# EAGLE design audio (EAGLE 7.7.0)
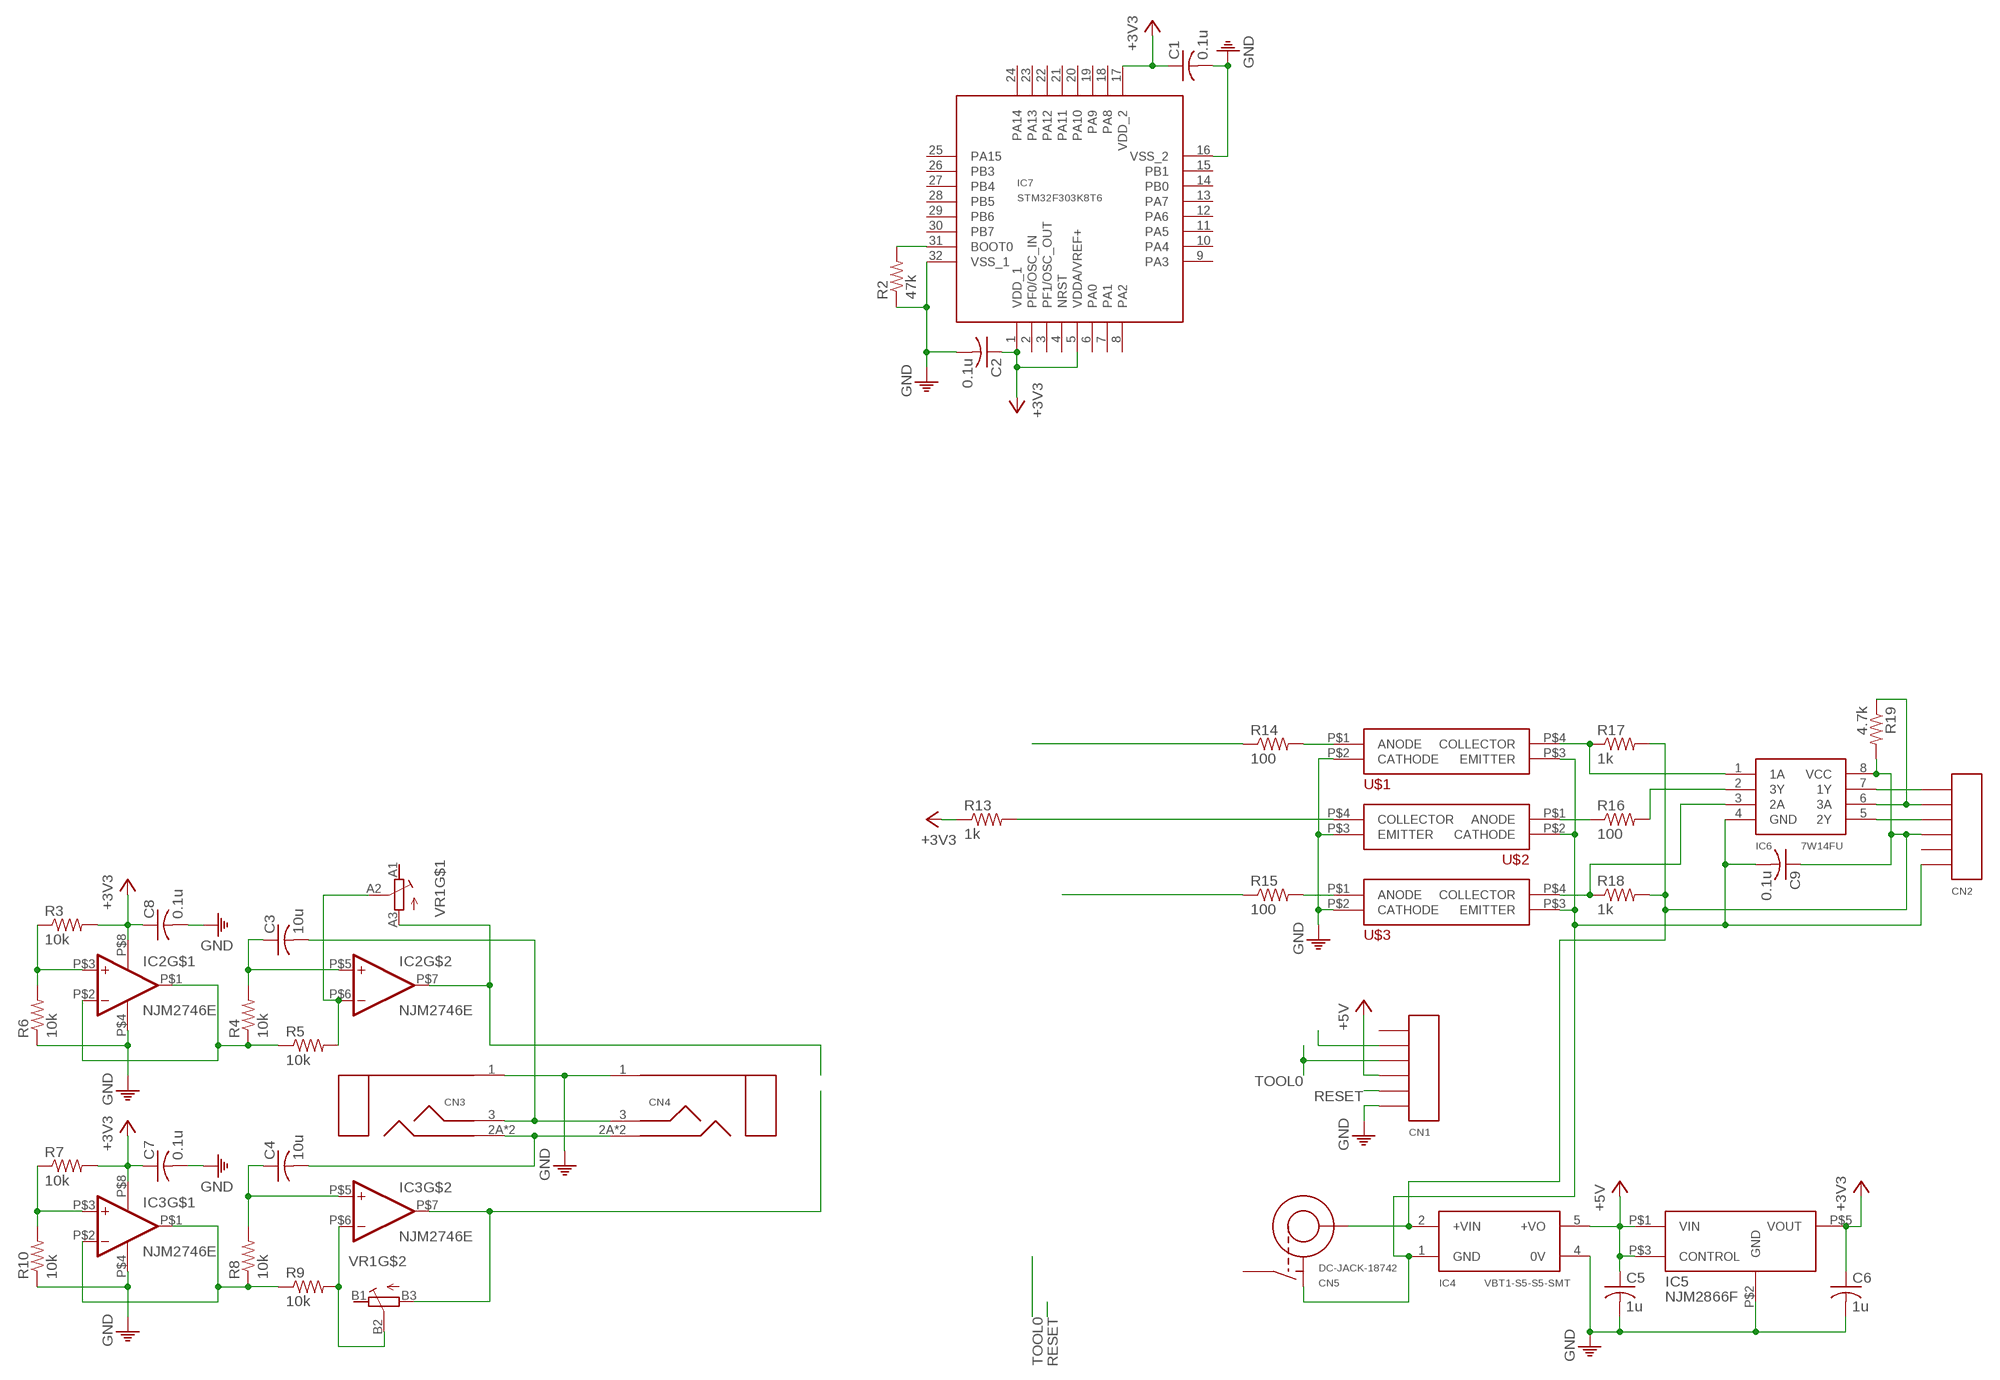
[diagram p0: schematic, sheet 1]

## Parts
C1  0.1u  C2012  [C2012]
C2  0.1u  C2012  [C2012]
C3  10u  C2012  [C2012]
C4  10u  C2012  [C2012]
C5  1u  C2012  [C2012]
C6  1u  C2012  [C2012]
C7  0.1u  C2012  [C2012]
C8  0.1u  C2012  [C2012]
C9  0.1u  C2012  [C2012]
CN1  PH-1X06SG  [PH-1X06SG]
CN2  PH-1X06RG  [PH-1X06RG]
CN3  STEREO-3.5-MJ8435  [MJ8435]
CN4  STEREO-3.5-MJ8435  [MJ8435]
CN5  DC-JACK-18742  [18742]
IC2  NJM2746E  [EMP8]
IC3  NJM2746E  [EMP8]
IC4  VBT1-S5-S5-SMT  [VBT1-S5-S5-SMT]
IC5  NJM2866F  [SOT-23-5]
IC6  7W14FU  [SSOP8-P-0.65]
IC7  STM32F303K8T6  [P-LQFP32-7X7-0.80]
R2  47k  R2012  [R2012]
R3  10k  R2012  [R2012]
R4  10k  R2012  [R2012]
R5  10k  R2012  [R2012]
R6  10k  R2012  [R2012]
R7  10k  R2012  [R2012]
R8  10k  R2012  [R2012]
R9  10k  R2012  [R2012]
R10  10k  R2012  [R2012]
R13  1k  R2012  [R2012]
R14  100  R2012  [R2012]
R15  100  R2012  [R2012]
R16  100  R2012  [R2012]
R17  1k  R2012  [R2012]
R18  1k  R2012  [R2012]
R19  4.7k  R2012  [R2012]
U$1  TLP291  [11-3C1]
U$2  TLP291  [11-3C1]
U$3  TLP291  [11-3C1]
VR1  R-TRIM-RK0971220  [RK0971220-F15-C0-A104]

## Nets
+3V3: C1.1 C2.1 C6.1 C7.1 C8.1 IC2.P$8(V+) IC3.P$8(V+) IC5.P$5(VOUT) IC7.1(VDD_1) IC7.5(VDDA/VREF+) IC7.17(VDD_2) R3.2 R7.2 R13.1
+5V: C5.1 CN1.P$4 IC4.5(+VO) IC5.P$1(VIN) IC5.P$3(CONTROL)
GND: C1.2 C2.2 C5.2 C6.2 C7.2 C8.2 CN1.P$6 CN3.1(SLEEVE) CN4.1(SLEEVE) IC2.P$4(V-) IC3.P$4(V-) IC4.4(0V) IC5.P$2(GND) IC7.16(VSS_2) IC7.32(VSS_1) R2.1 R6.1 R10.1 U$1.P$2(CATHODE) U$2.P$3(EMITTER) U$3.P$2(CATHODE)
N$1: IC2.P$1(OUT) IC2.P$2(-IN) R4.1 R5.1
N$2: IC7.31(BOOT0) R2.2
N$3: C3.2 CN3.3(RING) CN4.3(RING)
N$4: CN1.P$2
N$5: C3.1 IC2.P$5(+IN) R4.2
N$6: IC2.P$3(+IN) R3.1 R6.2
N$7: C9.2 CN2.P$6 CN5.P$2(TIP) IC4.1(GND) IC6.4(GND) U$1.P$3(EMITTER) U$2.P$2(CATHODE) U$3.P$3(EMITTER)
N$8: C9.1 CN2.P$4 CN5.P$1(CENTER) IC4.2(+VIN) IC6.8(VCC) R17.2 R18.2 R19.2
N$9: IC2.P$6(-IN) R5.2 VR1.A2(S)
N$10: IC2.P$7(OUT) VR1.A3(E)
N$11: IC3.P$1(OUT) IC3.P$2(-IN) R8.1 R9.1
N$12: IC3.P$3(+IN) R7.1 R10.2
N$13: C4.1 IC3.P$5(+IN) R8.2
N$14: IC3.P$6(-IN) R9.2 VR1.B2(S)
N$15: C4.2 CN3.2A(TIP) CN3.2B(TIP) CN4.2A(TIP) CN4.2B(TIP)
N$16: IC3.P$7(OUT) VR1.B3(E)
N$17: R14.1
N$18: R13.2 U$2.P$4(COLLECTOR)
N$19: R15.1
N$20: R14.2 U$1.P$1(ANODE)
N$21: IC6.3(2A) R18.1 U$3.P$4(COLLECTOR)
N$22: R15.2 U$3.P$1(ANODE)
N$23: R16.1 U$2.P$1(ANODE)
N$24: CN2.P$1 IC6.7(1Y)
N$25: IC6.1(1A) R17.1 U$1.P$4(COLLECTOR)
N$26: CN2.P$2 IC6.6(3A) R19.1
N$27: CN2.P$3 IC6.5(2Y)
N$28: IC6.2(3Y) R16.2
RESET: CN1.P$5
TOOL0: CN1.P$3
Unconnected: CN1.P$1 CN2.P$5 CN5.P$3(SHUNT) IC7.2(PF0/OSC_IN) IC7.3(PF1/OSC_OUT) IC7.4(NRST) IC7.6(PA0) IC7.7(PA1) IC7.8(PA2) IC7.9(PA3) IC7.10(PA4) IC7.11(PA5) IC7.12(PA6) IC7.13(PA7) IC7.14(PB0) IC7.15(PB1) IC7.18(PA8) IC7.19(PA9) IC7.20(PA10) IC7.21(PA11) IC7.22(PA12) IC7.23(PA13) IC7.24(PA14) IC7.25(PA15) IC7.26(PB3) IC7.27(PB4) IC7.28(PB5) IC7.29(PB6) IC7.30(PB7) VR1.A1(A) VR1.B1(A)

## Library data of the parts
C1-C9 = MyLib:C: CAPACITOR, American symbol
CN1 CN2 = MyLib:PH-1X06
CN3 CN4 = MyLib:STEREO
CN5 = MyLib:DC-JACK
IC2 IC3 = MyLib:NJM2746
IC4 = MyLib:VBT1-S5-S5-SMT
IC5 = MyLib:NJM2866F
IC6 = MyLib:7*14
IC7 = MyLib:STM32F303K8T6
R2-R10 R13-R19 = MyLib:R: RESISTOR, American symbol
U$1-U$3 = MyLib:TLP291
VR1 = MyLib:R-TRIM

## Board
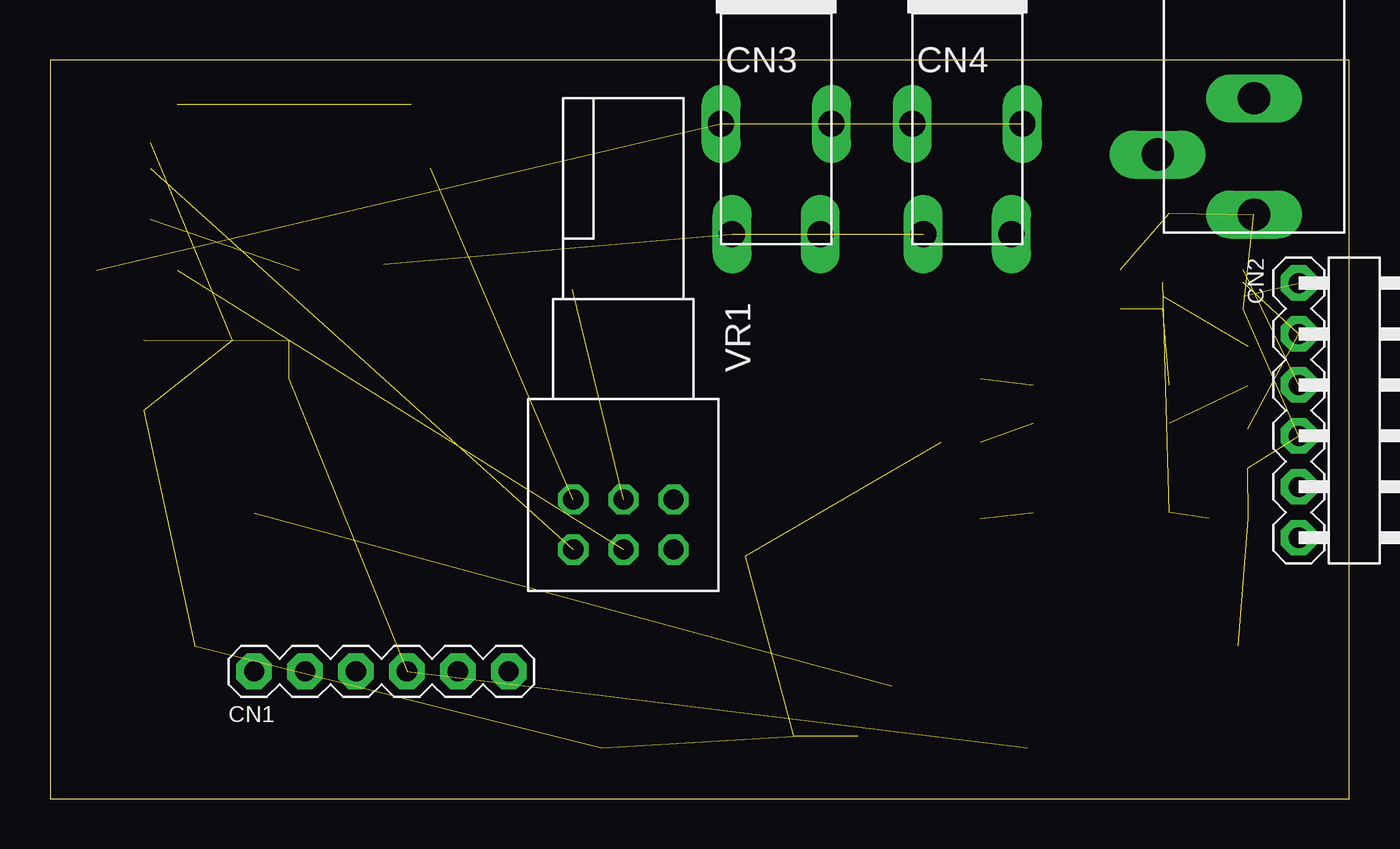
[diagram p1: board, top side]
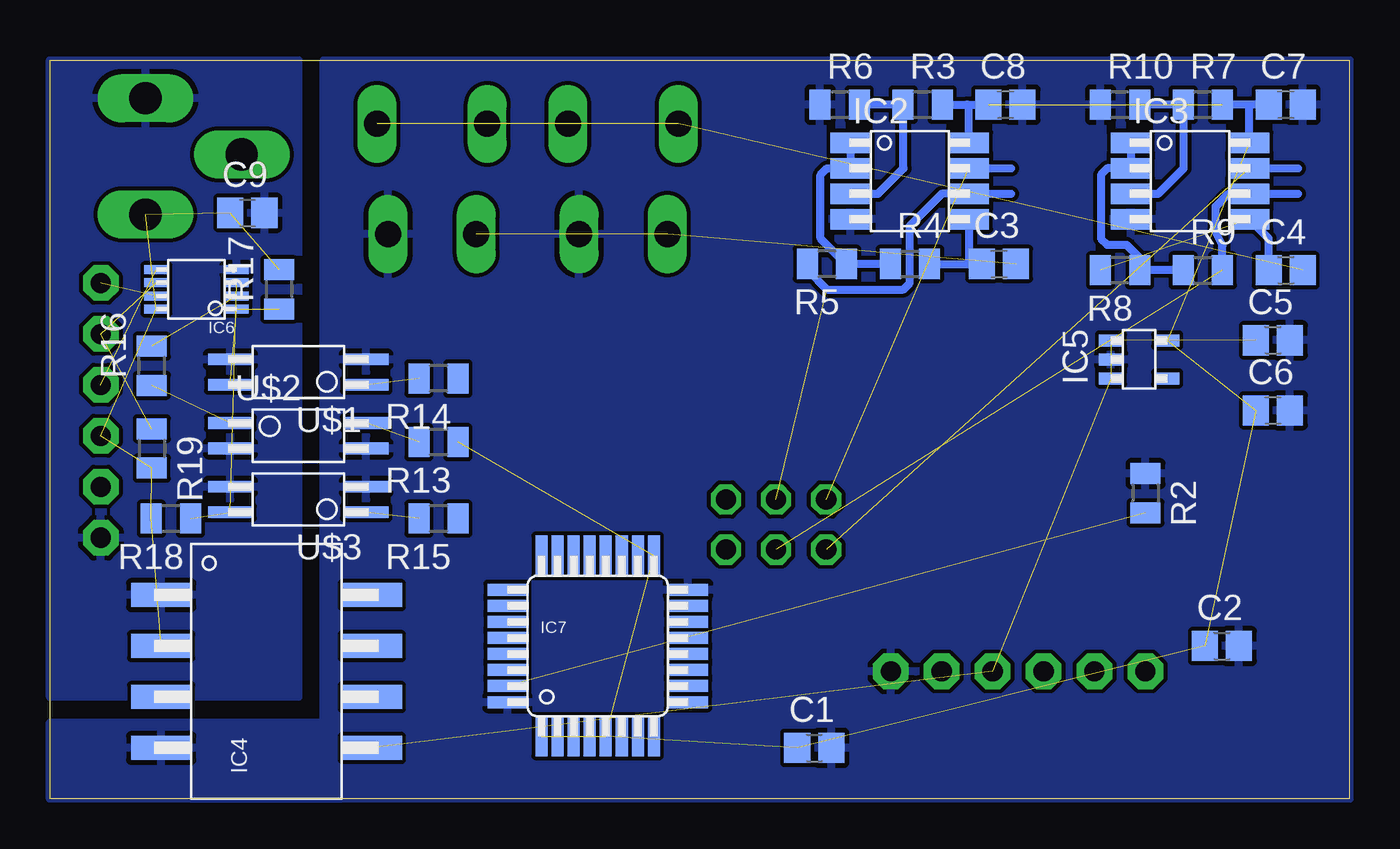
[diagram p2: board, bottom side, seen from below]

Size 64.76 x 36.82 mm. Coordinates in mm from the lower left corner, seen from the top.
Outline: 0,0 64.76,0 64.76,36.82 0,36.82 0,0
Copper layers (1*16): Top 0.0356mm / dielectric 1.5011mm / Bottom 0.0356mm
Design rules "formitaminimum": minimum track width 5mil, minimum drill 0.5994mm, track to track 0.2007mm, track to pad 0.2007mm, pad to pad 0.2007mm, via to via 0.2007mm, smd to smd 0mil, copper to edge 0mil, drill to drill 1mil, minimum pad ring 10mil, minimum via ring 8mil, stop-mask expansion 4mil, vias tented up to drill 0mil, thermal gap 10mil

### Footprints (pad centres in the part's own frame; a part is rotated, then mirrored left to right if it is on the bottom)
C2012 = smd 1.3 x 1.5: 1 -0.85,0; 2 0.85,0
PH-1X06SG = drill 1 pad 1.778 octagon: P$1 -6.35,0; P$2 -3.81,0; P$3 -1.27,0; P$4 1.27,0; P$5 3.81,0; P$6 6.35,0
PH-1X06RG = drill 1 pad 1.778 octagon: P$1 -6.35,0; P$2 -3.81,0; P$3 -1.27,0; P$4 1.27,0; P$5 3.81,0; P$6 6.35,0
MJ8435 = drill 1.3 long: 1 2.2,-5.5; 2A -2.75,0; 2B 2.75,0; 3 -2.2,-5.5
18742 = drill 1.6 long: P$1 5.8,0; P$2 0,0; P$3 2.8,-4.8
EMP8 = smd 2 x 1.016: P$1 -2.95,1.905; P$2 -2.95,0.635; P$3 -2.95,-0.635; P$4 -2.95,-1.905; P$5 2.95,-1.905; P$6 2.95,-0.635; P$7 2.95,0.635; P$8 2.95,1.905
VBT1-S5-S5-SMT = smd 3 x 1.2: 1 -5.25,3.81; 2 -5.25,1.27; 3 -5.25,-1.27; 4 -5.25,-3.81; 5 5.25,-3.81; 6 5.25,-1.27; 7 5.25,1.27; 8 5.25,3.81
SOT-23-5 = smd 1.2 x 0.6: P$1 -1.4,0.95; P$2 -1.4,0; P$3 -1.4,-0.95; P$4 1.4,-0.95; P$5 1.4,0.95
SSOP8-P-0.65 = smd 1.2 x 0.45: 1 -2,0.975; 2 -2,0.325; 3 -2,-0.325; 4 -2,-0.975; 5 2,-0.975; 6 2,-0.325; 7 2,0.325; 8 2,0.975
P-LQFP32-7X7-0.80 = smd 0.6 x 2: 1 -2.8,-4.5; 2 -2,-4.5; 3 -1.2,-4.5; 4 -0.4,-4.5; 5 0.4,-4.5; 6 1.2,-4.5; 7 2,-4.5; 8 2.8,-4.5; 17 2.8,4.5; 18 2,4.5; 19 1.2,4.5; 20 0.4,4.5; 21 -0.4,4.5; 22 -1.2,4.5; 23 -2,4.5; 24 -2.8,4.5 | smd 2 x 0.6: 9 4.5,-2.8; 10 4.5,-2; 11 4.5,-1.2; 12 4.5,-0.4; 13 4.5,0.4; 14 4.5,1.2; 15 4.5,2; 16 4.5,2.8; 25 -4.5,2.8; 26 -4.5,2; 27 -4.5,1.2; 28 -4.5,0.4; 29 -4.5,-0.4; 30 -4.5,-1.2; 31 -4.5,-2; 32 -4.5,-2.8
R2012 = smd 1.046 x 1.5: 1 -0.977,0; 2 0.977,0
11-3C1 = smd 2.225 x 0.58: P$1 -3.388,0.635; P$2 -3.388,-0.635; P$3 3.388,-0.635; P$4 3.388,0.635
RK0971220-F15-C0-A104 = drill 1 octagon: A1 2.5,0; A2 0,0; A3 -2.5,0; B1 2.5,-2.5; B2 0,-2.5; B3 -2.5,-2.5

### Placement (x,y rotation side)
C1  26.67,2.54 0 bottom
C2  6.35,7.62 0 bottom
C3  17.46,26.67 0 bottom
C4  3.17,26.35 0 bottom
C5  3.81,22.86 0 bottom
C6  3.81,19.37 0 bottom
C7  3.17,34.61 0 bottom
C8  17.14,34.61 0 bottom
C9  54.93,29.21 0 bottom
CN1  16.51,6.35 0 top
CN2  62.23,19.37 270 top
CN3  36.2,33.66 0 top
CN4  45.72,33.66 0 top
CN5  60.01,34.92 270 top
IC2  21.91,30.8 0 bottom
IC3  7.94,30.8 0 bottom
IC4  53.98,6.35 0 bottom
IC5  10.48,21.91 0 bottom
IC6  57.47,25.4 180 bottom
IC7  37.47,7.62 0 bottom
R2  10.16,15.24 270 bottom
R3  21.27,34.61 0 bottom
R4  21.91,26.67 0 bottom
R5  26.04,26.67 180 bottom
R6  25.4,34.61 0 bottom
R7  7.3,34.61 0 bottom
R8  11.43,26.35 180 bottom
R9  7.3,26.35 0 bottom
R10  11.43,34.61 0 bottom
R13  45.4,17.78 180 bottom
R14  45.4,20.95 180 bottom
R15  45.4,13.97 180 bottom
R16  59.69,21.59 90 bottom
R17  53.34,25.4 90 bottom
R18  58.74,13.97 180 bottom
R19  59.69,17.46 270 bottom
U$1  52.39,21.27 180 bottom
U$2  52.39,18.1 0 bottom
U$3  52.39,14.92 180 bottom
VR1  28.57,14.92 0 top

### Tracks (layer width: path | path; a pad name or v marks a point on that pad's centre or on a via)
+3V3  (9 unrouted)
  Bottom 0.406: R3.2 19.05,34.61 | 19.05,34.61 C8.1 | IC2.P$8 18.96,34.52 19.05,34.61 | C7.1 5.08,34.61 | 5.08,34.61 R7.2 | IC3.P$8 4.99,34.52 5.08,34.61
+5V  (4 unrouted)
GND
  pour Bottom: 0,0 64.77,0 64.77,3.81 51.12,3.81 51.12,36.83 0,36.83
N$1
  Bottom 0.406: IC2.P$1 IC2.P$2 26.04,31.43 26.35,31.11 26.35,27.94 25.08,26.67 R5.1 R4.1
N$2  (1 unrouted)
N$3  (2 unrouted)
N$5
  Bottom 0.406: R4.2 19.05,26.67 | 19.05,26.67 C3.1 | IC2.P$5 18.96,26.76 19.05,26.67
N$6
  Bottom 0.406: R6.2 R3.1 22.23,34.58 22.23,31.43 23.5,30.16 IC2.P$3
N$7
  pour Bottom: 52.39,5.08 64.77,5.08 64.77,36.83 52.39,36.83
N$8  (7 unrouted)
N$9  (1 unrouted)
  Bottom 0.406: 16.85,30.16 IC2.P$6 20.32,30.16 21.91,28.57 21.91,25.72 22.23,25.4 26.04,25.4 27.01,26.38 R5.2
N$10  (1 unrouted)
  Bottom 0.406: IC2.P$7 16.85,31.43
N$11
  Bottom 0.406: R9.1 R8.1 10.45,26.96 11.11,27.62 12.06,27.62 12.38,27.94 12.38,31.11 12.06,31.43 IC3.P$2 IC3.P$1
N$12
  Bottom 0.406: R10.2 R7.1 8.26,34.58 8.26,31.43 9.53,30.16 IC3.P$3
N$13  (1 unrouted)
  Bottom 0.406: C4.1 4.03,27.93 IC3.P$5
N$14  (1 unrouted)
  Bottom 0.406: 2.56,30.16 IC3.P$6 6.03,30.16 6.67,29.53 6.67,28.26 6.33,27.6 R9.2
N$15  (4 unrouted)
N$16  (1 unrouted)
  Bottom 0.406: IC3.P$7 2.56,31.43
N$18  (1 unrouted)
N$20  (1 unrouted)
N$21  (2 unrouted)
N$22  (1 unrouted)
N$23  (1 unrouted)
N$24  (1 unrouted)
N$25  (2 unrouted)
N$26  (2 unrouted)
N$27  (1 unrouted)
N$28  (1 unrouted)